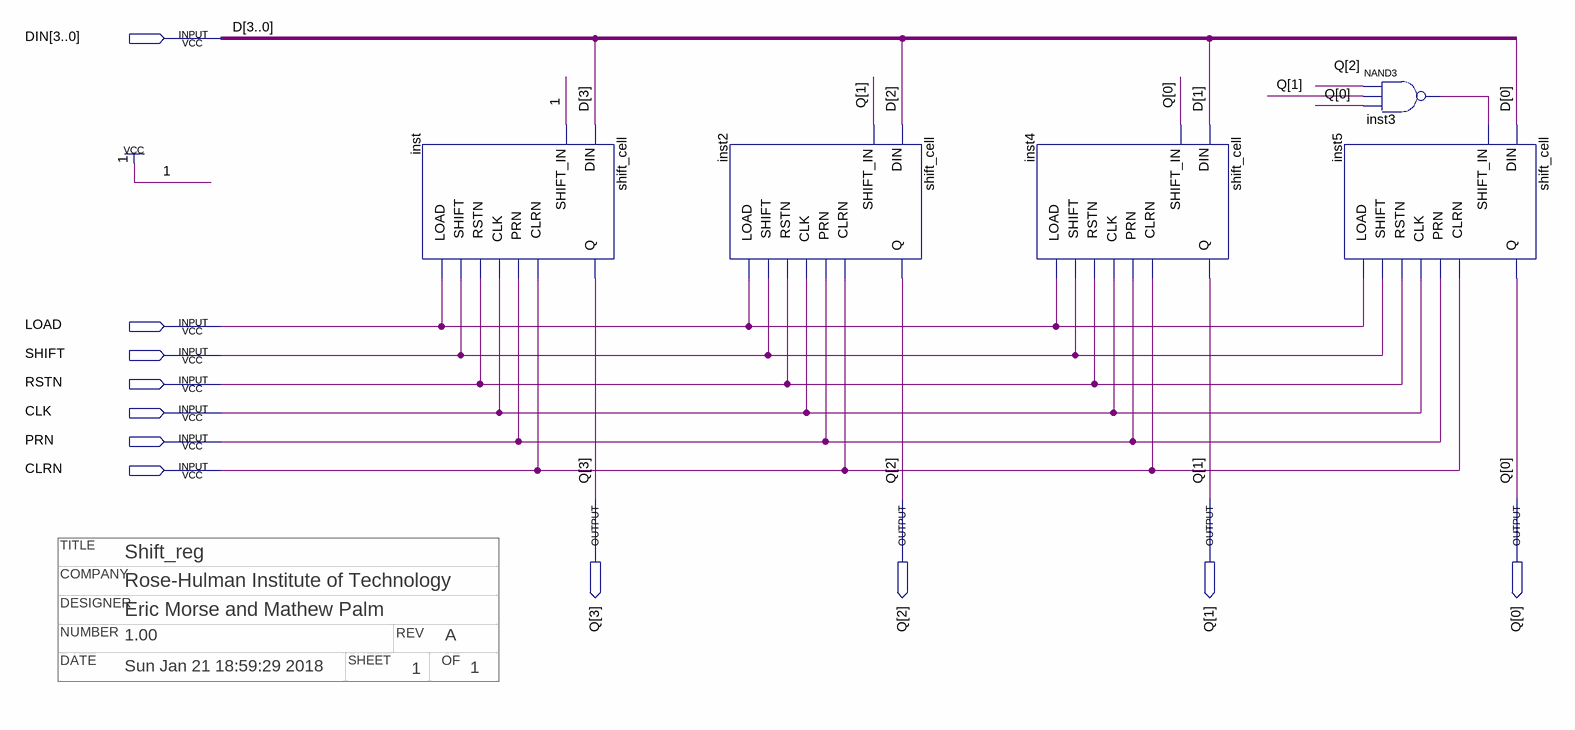
[diagram p0: schematic sheet]
// Quartus schematic shift_reg.bdf as structural Verilog: 5 symbols, 11 pins
// Title block: COMPANY: Rose-Hulman Institute of Technology; DATE: Sun Jan 21 18:59:29 2018; DESIGNER: Eric Morse and Mathew Palm; NUMBER: 1.00; OF: 1; REV: A; SHEET: 1; TITLE: Shift_reg
module shift_reg (
  input  [3:0] DIN,
  input  LOAD,
  input  SHIFT,
  input  RSTN,
  input  CLK,
  input  PRN,
  input  CLRN,
  output [3:0] Q
);

  wire inst3_out;

  shift_cell inst (
    .DIN(DIN[3]), .SHIFT_IN(1'b1), .LOAD(LOAD), .SHIFT(SHIFT), .RSTN(RSTN), .CLK(CLK), .PRN(PRN),
    .CLRN(CLRN), .Q(Q[3]));
  shift_cell inst2 (
    .DIN(DIN[2]), .SHIFT_IN(Q[1]), .LOAD(LOAD), .SHIFT(SHIFT), .RSTN(RSTN), .CLK(CLK), .PRN(PRN),
    .CLRN(CLRN), .Q(Q[2]));
  shift_cell inst4 (
    .DIN(DIN[1]), .SHIFT_IN(Q[0]), .LOAD(LOAD), .SHIFT(SHIFT), .RSTN(RSTN), .CLK(CLK), .PRN(PRN),
    .CLRN(CLRN), .Q(Q[1]));
  shift_cell inst5 (
    .DIN(DIN[0]), .SHIFT_IN(inst3_out), .LOAD(LOAD), .SHIFT(SHIFT), .RSTN(RSTN), .CLK(CLK), .PRN(PRN),
    .CLRN(CLRN), .Q(Q[0]));
  nand inst3 (inst3_out, Q[2], Q[1], Q[0]);

  // Other names for the same wires on the sheet: D[3:0] = DIN
endmodule
